# EAGLE design Schematic_v1.0 (EAGLE 6.2)
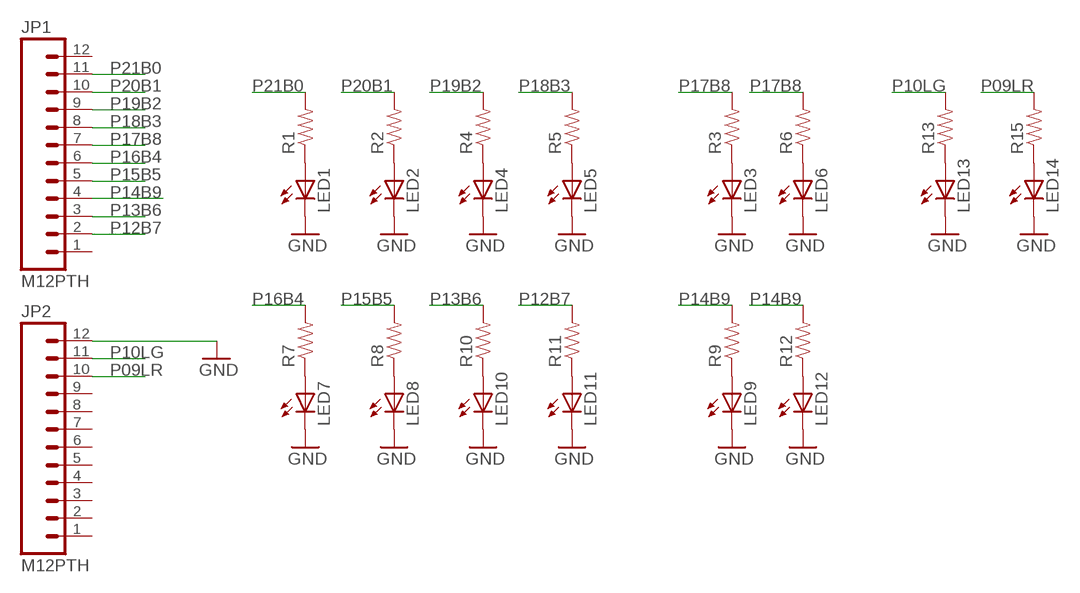
[diagram p0: schematic, sheet 1]

## Parts
JP1  M12PTH  [1X12]
JP2  M12PTH  [1X12]
LED1  LEDCHIPLED_0805  [CHIPLED_0805]
LED2  LEDCHIPLED_0805  [CHIPLED_0805]
LED3  LEDCHIPLED_0805  [CHIPLED_0805]
LED4  LEDCHIPLED_0805  [CHIPLED_0805]
LED5  LEDCHIPLED_0805  [CHIPLED_0805]
LED6  LEDCHIPLED_0805  [CHIPLED_0805]
LED7  LEDCHIPLED_0805  [CHIPLED_0805]
LED8  LEDCHIPLED_0805  [CHIPLED_0805]
LED9  LEDCHIPLED_0805  [CHIPLED_0805]
LED10  LEDCHIPLED_0805  [CHIPLED_0805]
LED11  LEDCHIPLED_0805  [CHIPLED_0805]
LED12  LEDCHIPLED_0805  [CHIPLED_0805]
LED13  LEDCHIPLED_0805  [CHIPLED_0805]
LED14  LEDCHIPLED_0805  [CHIPLED_0805]
R1  RESISTOR0603-RES  [0603-RES]
R2  RESISTOR0603-RES  [0603-RES]
R3  RESISTOR0603-RES  [0603-RES]
R4  RESISTOR0603-RES  [0603-RES]
R5  RESISTOR0603-RES  [0603-RES]
R6  RESISTOR0603-RES  [0603-RES]
R7  RESISTOR0603-RES  [0603-RES]
R8  RESISTOR0603-RES  [0603-RES]
R9  RESISTOR0603-RES  [0603-RES]
R10  RESISTOR0603-RES  [0603-RES]
R11  RESISTOR0603-RES  [0603-RES]
R12  RESISTOR0603-RES  [0603-RES]
R13  RESISTOR0603-RES  [0603-RES]
R15  RESISTOR0603-RES  [0603-RES]

## Nets
GND: JP2.12 LED1.C LED2.C LED3.C LED4.C LED5.C LED6.C LED7.C LED8.C LED9.C LED10.C LED11.C LED12.C LED13.C LED14.C
N$1: LED13.A R13.1
N$2: LED7.A R7.1
N$3: LED3.A R3.1
N$4: LED4.A R4.1
N$5: LED5.A R5.1
N$6: LED6.A R6.1
N$7: LED2.A R2.1
N$8: LED8.A R8.1
N$9: LED9.A R9.1
N$10: LED10.A R10.1
N$11: LED11.A R11.1
N$12: LED12.A R12.1
N$13: LED1.A R1.1
N$18: LED14.A R15.1
P09LR: JP2.10 R15.2
P10LG: JP2.11 R13.2
P12B7: JP1.2 R11.2
P13B6: JP1.3 R10.2
P14B9: JP1.4 R9.2 R12.2
P15B5: JP1.5 R8.2
P16B4: JP1.6 R7.2
P17B8: JP1.7 R3.2 R6.2
P18B3: JP1.8 R5.2
P19B2: JP1.9 R4.2
P20B1: JP1.10 R2.2
P21B0: JP1.11 R1.2
Unconnected: JP1.1 JP1.12 JP2.1 JP2.2 JP2.3 JP2.4 JP2.5 JP2.6 JP2.7 JP2.8 JP2.9

## Library data of the parts
JP1 JP2 = SparkFun-Connectors:M12: Header 12 Standard 12-pin 0.1" header. Use with straight break away headers (SKU : PRT-00116), right angle break away headers (PRT-00553), swiss pins (PRT-00743), machine pins (PRT-00117), and female headers (PRT-00115).
LED1-LED14 = adafruit:LED: LED OSRAM: - CHIPLED LG R971, LG N971, LY N971, LG Q971, LY Q971, LO R971, LY R971 LH N974, LH R974 LS Q976, LO Q976, LY Q976 LO Q996 - Hyper CHIPLED LW Q18S LB Q993, LB Q99A, LB R99A - SideLED LS A670, LO A670, LY A670, LG A670, LP A670 LB A673, LV A673, LT A673, LW A673 LH A674 LY A675 LS A676, LA A676, LO A676, LY A676, LW A676 LS A679, LY A679, LG A679 - Hyper Micro SIDELED® LS Y876, LA Y876, LO Y876, LY Y876 LT Y87S - SmartLED LW L88C, LW L88S LB L89C, LB L89S, LG L890 LS L89K, LO L89K, LY L89K LS L896, LA L896, LO L896, LY L896 - TOPLED LS T670, LO T670, LY T670, LG T670, LP T670 LSG T670, LSP T670, LSY T670, LOP T670, LYG T670 LG T671, LOG T671, LSG T671 LB T673, LV T673, LT T673, LW T673 LH T674 LS T676, LA T676, LO T676, LY T676, LB T676, LH T676, LSB T676, LW T676 LB T67C, LV T67C, LT T67C, LS T67K, LO T67K, LY T67K, LW E67C LS E67B, LA E67B, LO E67B, LY E67B, LB E67C, LV E67C, LT E67C LW T67C LS T679, LY T679, LG T679 LS T770, LO T770, LY T770, LG T770, LP T770 LB T773, LV T773, LT T773, LW T773 LH T774 LS E675, LA E675, LY E675, LS T675 LS T776, LA T776, LO T776, LY T776, LB T776 LHGB T686 LT T68C, LB T68C - Hyper Mini TOPLED® LB M676 - Mini TOPLED Santana® LG M470 LS M47K, LO M47K, LY M47K Source: http://www.osram.convergy.de/
R1-R13 R15 = SparkFun-Passives:RESISTOR: Resistor Basic schematic elements and footprints for 0603, 1206, and PTH resistors.

## Board
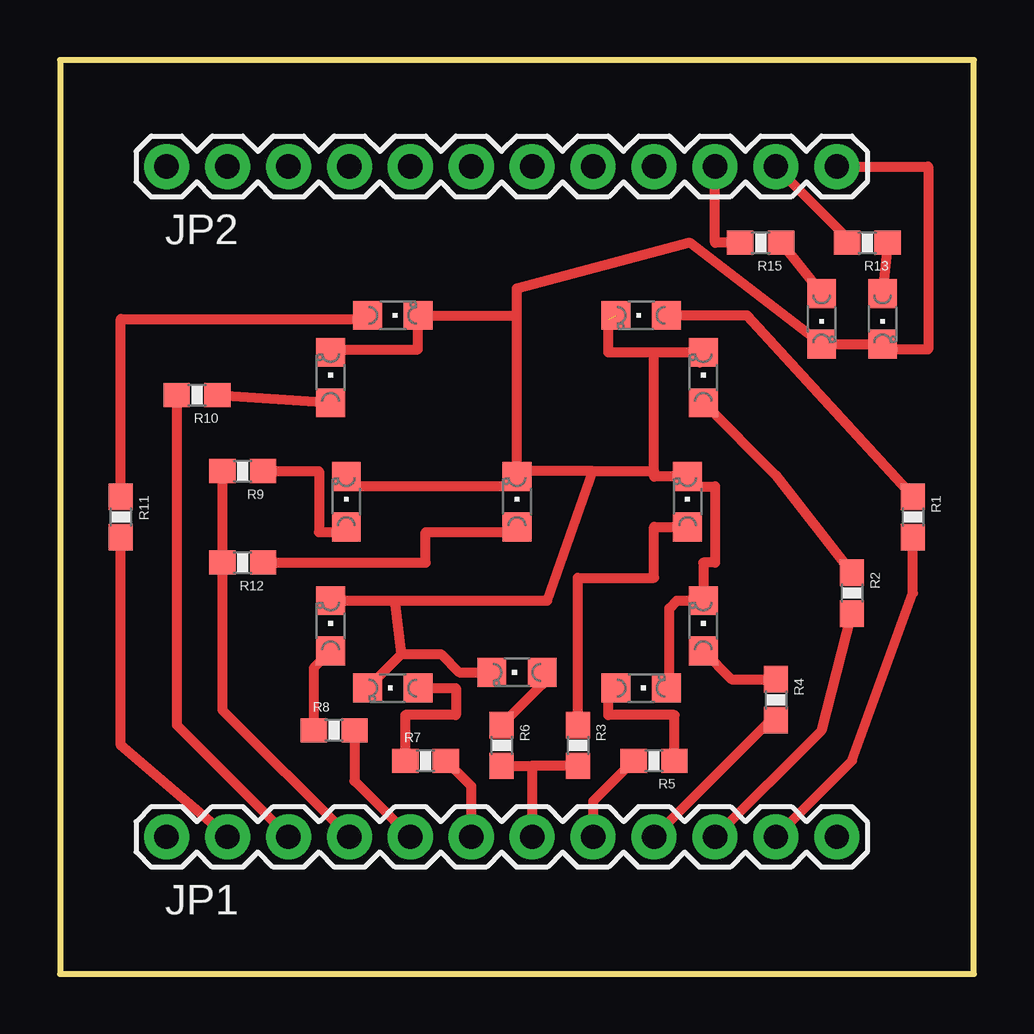
[diagram p1: board, top side]

Size 38.1 x 38.1 mm. Coordinates in mm from the lower left corner, seen from the top.
Outline: 0,0 38.1,0 38.1,38.1 0,38.1 0,0
Copper layers (1*16): Top 0.035mm / dielectric 1.5mm / Bottom 0.035mm
Design rules: minimum track width 10mil, minimum drill 24mil, track to track 8mil, track to pad 8mil, pad to pad 8mil, via to via 8mil, smd to smd 8mil, copper to edge 40mil, drill to drill 8mil, minimum pad ring 10mil, minimum via ring 8mil, stop-mask expansion 4mil, vias tented up to drill 0mil, thermal gap 10mil

### Footprints (pad centres in the part's own frame; a part is rotated, then mirrored left to right if it is on the bottom)
1X12 = drill 1.016 pad 1.88: 1 0,0; 2 2.54,0; 3 5.08,0; 4 7.62,0; 5 10.16,0; 6 12.7,0; 7 15.24,0; 8 17.78,0; 9 20.32,0; 10 22.86,0; 11 25.4,0; 12 27.94,0
CHIPLED_0805 = smd 1.2 x 1.2: A 0,-1.05; C 0,1.05
0603-RES = smd 1.1 x 1: 1 -0.85,0; 2 0.85,0

### Placement (x,y rotation side)
JP1  4.45,5.71 0 top
JP2  4.45,33.66 0 top
LED1  24.23,27.45 90 top
LED2  26.82,24.86 0 top
LED3  26.16,19.68 0 top
LED4  26.82,14.51 0 top
LED5  24.23,11.92 270 top
LED6  19.05,12.57 90 top
LED7  13.87,11.92 90 top
LED8  11.28,14.51 0 top
LED9  11.94,19.68 0 top
LED10  11.28,24.86 0 top
LED11  13.87,27.45 270 top
LED12  19.05,19.68 0 top
LED13  34.29,27.3 180 top
LED14  31.75,27.3 180 top
R1  35.56,19.05 270 top
R2  33.02,15.88 270 top
R3  21.59,9.53 270 top
R4  29.84,11.43 270 top
R5  24.77,8.89 180 top
R6  18.41,9.53 270 top
R7  15.24,8.89 0 top
R8  11.43,10.16 0 top
R9  7.62,20.95 180 top
R10  5.71,24.13 180 top
R11  2.54,19.05 270 top
R12  7.62,17.14 180 top
R13  33.66,30.48 180 top
R15  29.21,30.48 180 top

### Tracks (layer width: path | path; a pad name or v marks a point on that pad's centre or on a via)
GND  (1 unrouted)
  Top 0.254: 25.4,11.43 LED5.C | 22.86,27.94 LED1.C | 26.67,20.32 LED3.C | 26.67,25.4 LED2.C | 19.05,20.32 17.78,20.32 | 11.43,20.32 LED9.C | 17.78,12.7 LED6.C | 11.43,26.04 LED10.C
  Top 0.406: LED9.C 11.94,20.32 19.05,20.32 LED12.C | LED12.C 19.05,27.45 | 19.05,27.45 19.05,28.57 26.25,30.48 LED14.C LED13.C 34.29,26.04 36.2,26.04 36.2,33.66 JP2.12 | LED2.C 24.77,25.91 | 24.77,25.91 22.86,25.91 22.86,27.3 | LED3.C 24.77,20.73 24.77,20.95 | 24.77,20.95 24.77,25.91 | LED8.C 13.97,15.56 | 13.97,15.56 20.32,15.56 22.23,20.95 | 22.23,20.95 24.77,20.95 | 11.43,26.04 14.92,26.04 LED11.C 19.05,27.45 | LED7.C 14.24,13.34 | 14.24,13.34 15.88,13.34 16.64,12.57 LED6.C | LED4.C 27.13,15.88 | 26.67,20.32 27.3,20.32 27.3,17.14 26.82,17.14 LED4.C | LED5.C 25.4,12.04 25.4,15.24 25.72,15.56 LED4.C | 22.23,20.95 19.05,20.95 LED12.C | 14.24,13.34 13.97,15.56
N$1
  Top 0.406: R13.1 LED13.A
N$2
  Top 0.406: LED7.A 16.51,11.92 16.51,10.79 14.39,10.79 R7.1
N$3
  Top 0.406: R3.1 21.59,16.51 24.77,16.51 24.77,18.64 LED3.A
N$4
  Top 0.406: LED4.A 28,12.28 R4.1
N$5
  Top 0.406: R5.1 25.61,10.79 22.86,10.79 22.86,11.92 LED5.A
N$6
  Top 0.406: R6.1 20.1,12.06 LED6.A
N$7
  Top 0.406: LED2.A 29.84,20.78 R2.1
N$8
  Top 0.406: LED8.A 10.58,12.76 R8.1
N$9
  Top 0.406: R9.1 10.79,20.95 10.79,18.41 11.94,18.41 LED9.A
N$10
  Top 0.406: R10.1 LED10.A
N$11
  Top 0.406: R11.1 2.54,27.3 12.82,27.3 LED11.A
N$12
  Top 0.406: R12.1 15.24,17.14 15.24,18.41 19.05,18.41 LED12.A
N$13
  Top 0.406: R1.1 28.64,27.45 LED1.A
N$18
  Top 0.406: R15.1 LED14.A
P09LR
  Top 0.406: R15.2 27.3,30.48 JP2.10
P10LG
  Top 0.406: R13.2 32.8,30.7 JP2.11
P12B7
  Top 0.406: JP1.2 2.54,9.53 R11.2
P13B6
  Top 0.406: R10.2 4.87,10.38 JP1.3
P14B9
  Top 0.406: JP1.4 6.77,11.01 R12.2 R9.2
P15B5
  Top 0.406: R8.2 12.28,8.04 JP1.5
P16B4
  Top 0.406: R7.2 17.14,7.83 JP1.6
P17B8
  Top 0.406: R6.2 19.68,8.68 | 19.68,8.68 JP1.7 | R3.2 19.68,8.68
P18B3
  Top 0.406: R5.2 22.23,7.2 JP1.8
P19B2
  Top 0.406: JP1.9 29.63,10.58 R4.2
P20B1
  Top 0.406: JP1.10 31.75,10.16 R2.2
P21B0
  Top 0.406: JP1.11 33.02,8.89 35.56,15.88 R1.2